# EAGLE design SmartBadge (EAGLE 9.1.3)
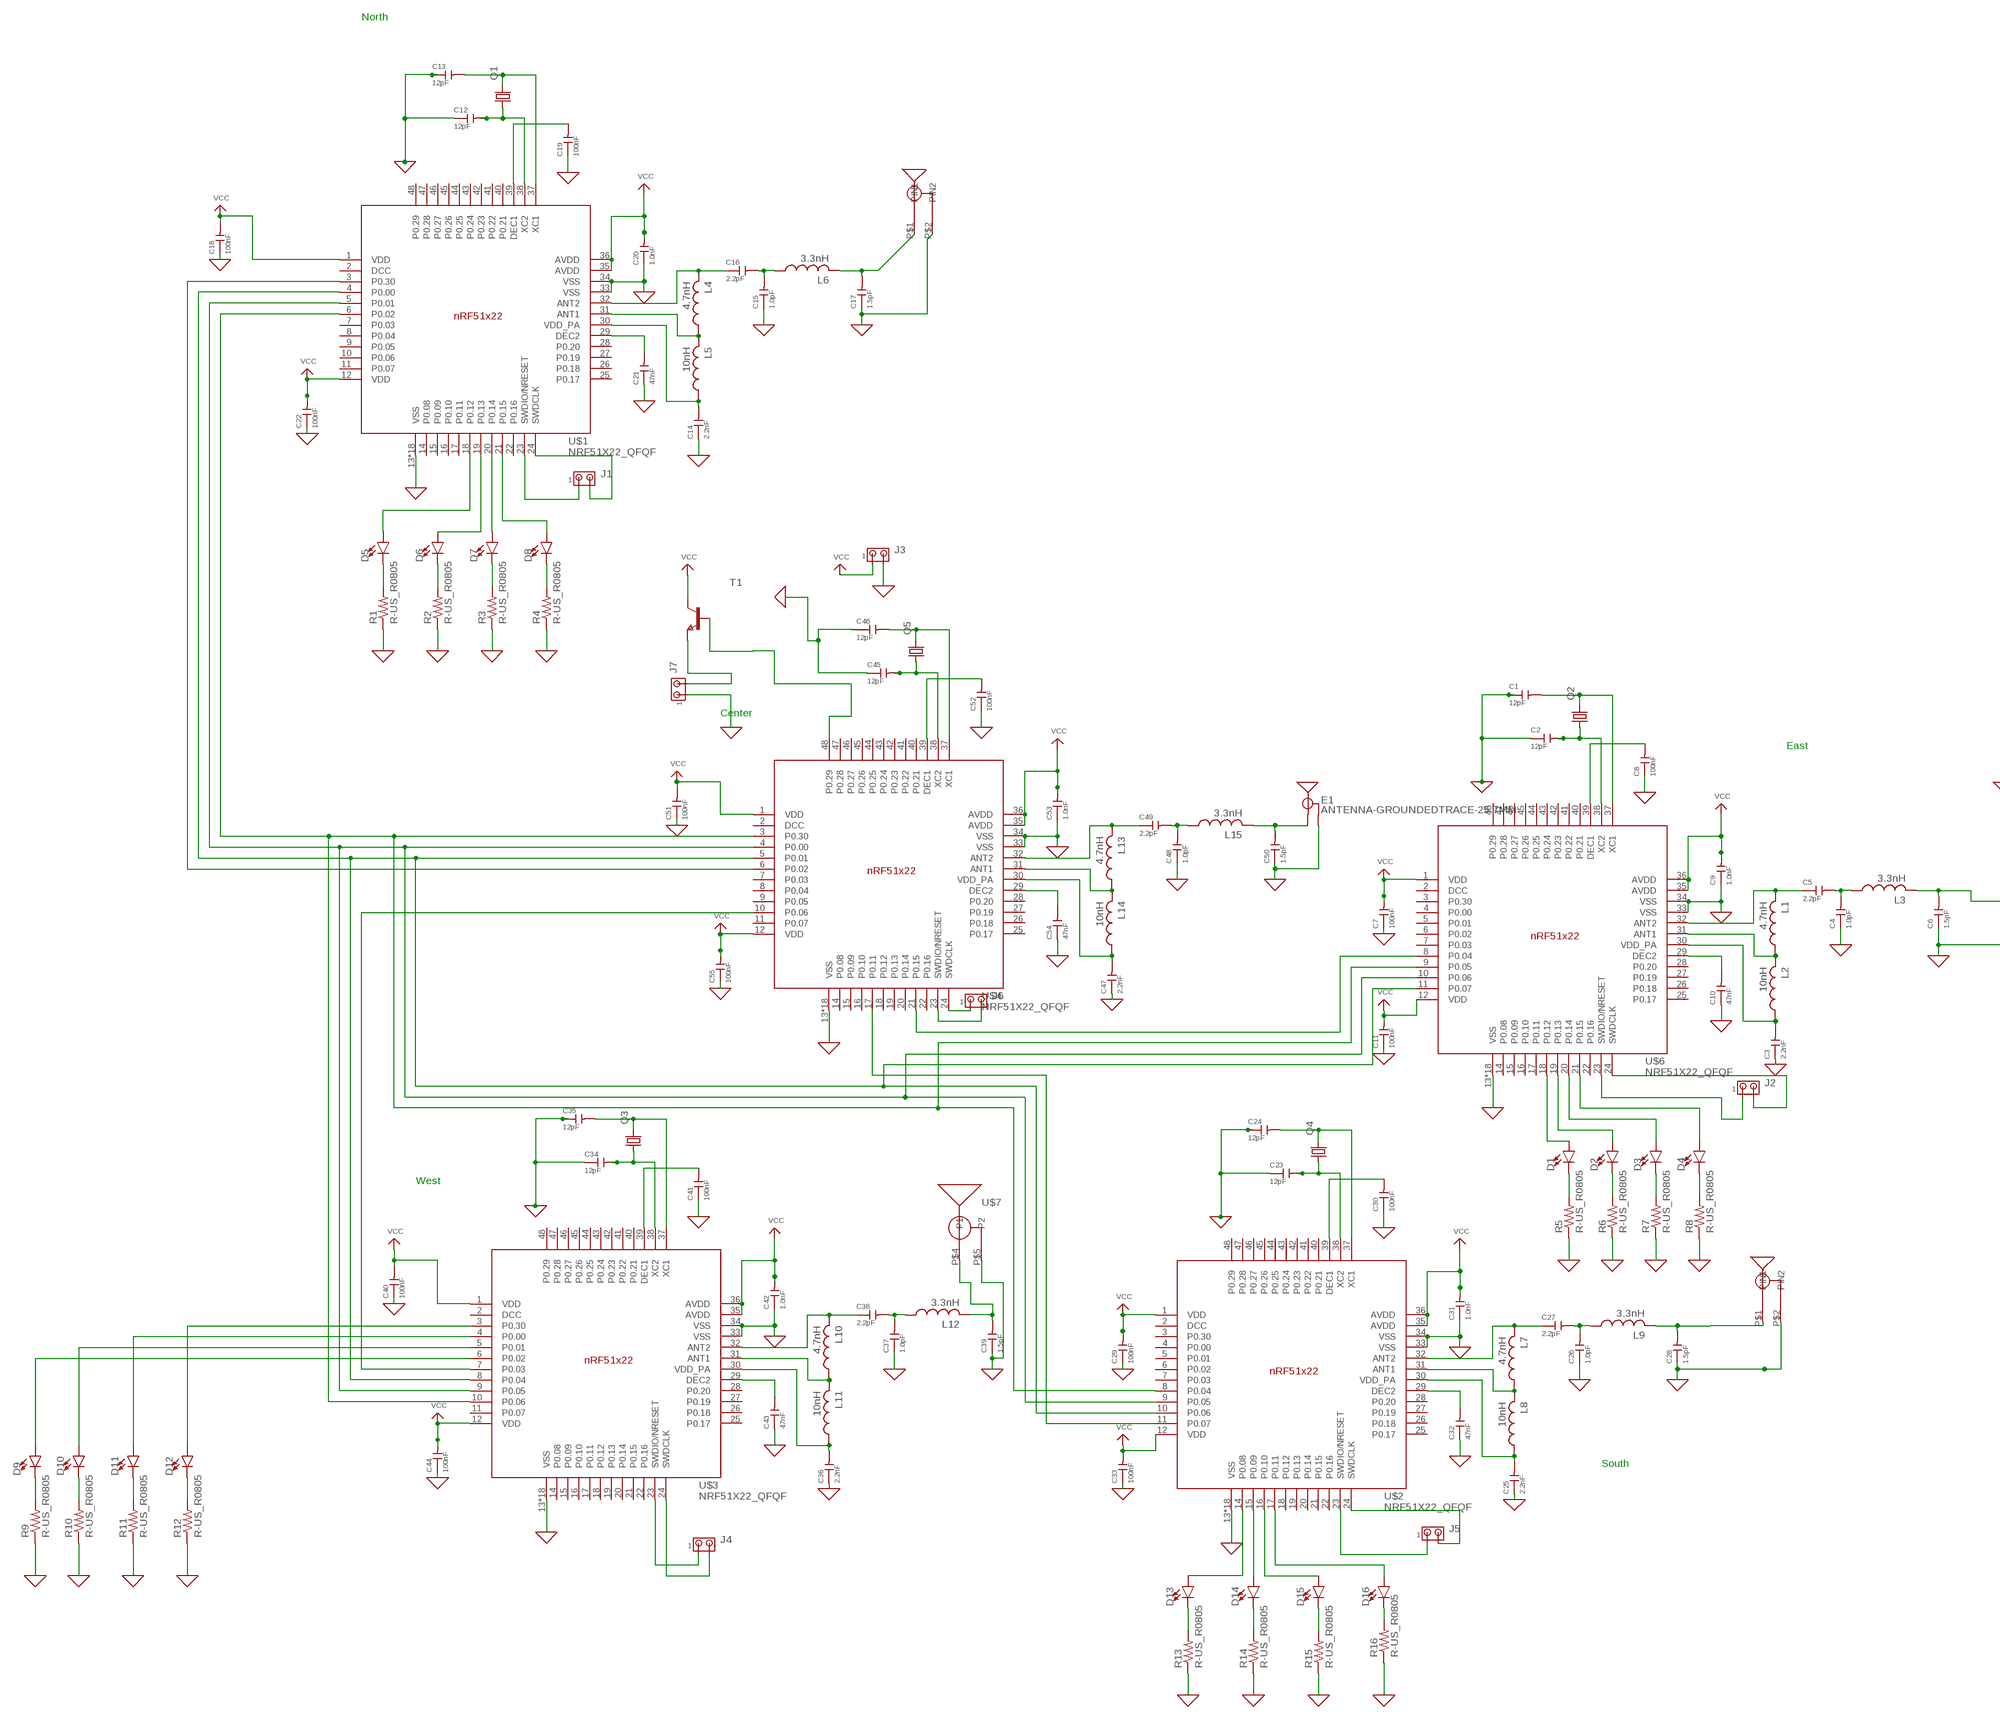
[diagram p0: schematic, sheet 1, part 1 of 2]
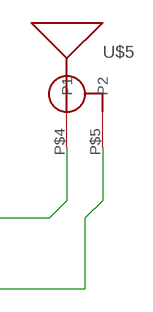
[diagram p1: schematic, sheet 1, part 2 of 2]

## Parts
C1  12pF  CERAMIC-22UF-6.3V-20%-X5R(0805)  [C0805]
C2  12pF  CERAMIC-22UF-6.3V-20%-X5R(0805)  [C0805]
C3  2.2nF  CERAMIC-22UF-6.3V-20%-X5R(0805)  [C0805]
C4  1.0pF  CERAMIC-22UF-6.3V-20%-X5R(0805)  [C0805]
C5  2.2pF  CERAMIC-22UF-6.3V-20%-X5R(0805)  [C0805]
C6  1.5pF  CERAMIC-22UF-6.3V-20%-X5R(0805)  [C0805]
C7  100nF  CERAMIC-22UF-6.3V-20%-X5R(0805)  [C0805]
C8  100nF  CERAMIC-22UF-6.3V-20%-X5R(0805)  [C0805]
C9  1.0nF  CERAMIC-22UF-6.3V-20%-X5R(0805)  [C0805]
C10  47nF  CERAMIC-22UF-6.3V-20%-X5R(0805)  [C0805]
C11  100nF  CERAMIC-22UF-6.3V-20%-X5R(0805)  [C0805]
C12  12pF  CERAMIC-22UF-6.3V-20%-X5R(0805)  [C0805]
C13  12pF  CERAMIC-22UF-6.3V-20%-X5R(0805)  [C0805]
C14  2.2nF  CERAMIC-22UF-6.3V-20%-X5R(0805)  [C0805]
C15  1.0pF  CERAMIC-22UF-6.3V-20%-X5R(0805)  [C0805]
C16  2.2pF  CERAMIC-22UF-6.3V-20%-X5R(0805)  [C0805]
C17  1.5pF  CERAMIC-22UF-6.3V-20%-X5R(0805)  [C0805]
C18  100nF  CERAMIC-22UF-6.3V-20%-X5R(0805)  [C0805]
C19  100nF  CERAMIC-22UF-6.3V-20%-X5R(0805)  [C0805]
C20  1.0nF  CERAMIC-22UF-6.3V-20%-X5R(0805)  [C0805]
C21  47nF  CERAMIC-22UF-6.3V-20%-X5R(0805)  [C0805]
C22  100nF  CERAMIC-22UF-6.3V-20%-X5R(0805)  [C0805]
C23  12pF  CERAMIC-22UF-6.3V-20%-X5R(0805)  [C0805]
C24  12pF  CERAMIC-22UF-6.3V-20%-X5R(0805)  [C0805]
C25  2.2nF  CERAMIC-22UF-6.3V-20%-X5R(0805)  [C0805]
C26  1.0pF  CERAMIC-22UF-6.3V-20%-X5R(0805)  [C0805]
C27  2.2pF  CERAMIC-22UF-6.3V-20%-X5R(0805)  [C0805]
C28  1.5pF  CERAMIC-22UF-6.3V-20%-X5R(0805)  [C0805]
C29  100nF  CERAMIC-22UF-6.3V-20%-X5R(0805)  [C0805]
C30  100nF  CERAMIC-22UF-6.3V-20%-X5R(0805)  [C0805]
C31  1.0nF  CERAMIC-22UF-6.3V-20%-X5R(0805)  [C0805]
C32  47nF  CERAMIC-22UF-6.3V-20%-X5R(0805)  [C0805]
C33  100nF  CERAMIC-22UF-6.3V-20%-X5R(0805)  [C0805]
C34  12pF  CERAMIC-22UF-6.3V-20%-X5R(0805)  [C0805]
C35  12pF  CERAMIC-22UF-6.3V-20%-X5R(0805)  [C0805]
C36  2.2nF  CERAMIC-22UF-6.3V-20%-X5R(0805)  [C0805]
C37  1.0pF  CERAMIC-22UF-6.3V-20%-X5R(0805)  [C0805]
C38  2.2pF  CERAMIC-22UF-6.3V-20%-X5R(0805)  [C0805]
C39  1.5pF  CERAMIC-22UF-6.3V-20%-X5R(0805)  [C0805]
C40  100nF  CERAMIC-22UF-6.3V-20%-X5R(0805)  [C0805]
C41  100nF  CERAMIC-22UF-6.3V-20%-X5R(0805)  [C0805]
C42  1.0nF  CERAMIC-22UF-6.3V-20%-X5R(0805)  [C0805]
C43  47nF  CERAMIC-22UF-6.3V-20%-X5R(0805)  [C0805]
C44  100nF  CERAMIC-22UF-6.3V-20%-X5R(0805)  [C0805]
C45  12pF  CERAMIC-22UF-6.3V-20%-X5R(0805)  [C0805]
C46  12pF  CERAMIC-22UF-6.3V-20%-X5R(0805)  [C0805]
C47  2.2nF  CERAMIC-22UF-6.3V-20%-X5R(0805)  [C0805]
C48  1.0pF  CERAMIC-22UF-6.3V-20%-X5R(0805)  [C0805]
C49  2.2pF  CERAMIC-22UF-6.3V-20%-X5R(0805)  [C0805]
C50  1.5pF  CERAMIC-22UF-6.3V-20%-X5R(0805)  [C0805]
C51  100nF  CERAMIC-22UF-6.3V-20%-X5R(0805)  [C0805]
C52  100nF  CERAMIC-22UF-6.3V-20%-X5R(0805)  [C0805]
C53  1.0nF  CERAMIC-22UF-6.3V-20%-X5R(0805)  [C0805]
C54  47nF  CERAMIC-22UF-6.3V-20%-X5R(0805)  [C0805]
C55  100nF  CERAMIC-22UF-6.3V-20%-X5R(0805)  [C0805]
D1  LED-GREEN0603  [LED-0603]
D2  LED-GREEN0603  [LED-0603]
D3  LED-GREEN0603  [LED-0603]
D4  LED-GREEN0603  [LED-0603]
D5  LED-GREEN0603  [LED-0603]
D6  LED-GREEN0603  [LED-0603]
D7  LED-GREEN0603  [LED-0603]
D8  LED-GREEN0603  [LED-0603]
D9  LED-GREEN0603  [LED-0603]
D10  LED-GREEN0603  [LED-0603]
D11  LED-GREEN0603  [LED-0603]
D12  LED-GREEN0603  [LED-0603]
D13  LED-GREEN0603  [LED-0603]
D14  LED-GREEN0603  [LED-0603]
D15  LED-GREEN0603  [LED-0603]
D16  LED-GREEN0603  [LED-0603]
E1  ANTENNA-GROUNDEDTRACE-25.7MM  [TRACE_ANTENNA_2.4GHZ_25.7MM]
J1  MTA02-100  [10X02MTA]
J2  MTA02-100  [10X02MTA]
J3  MTA02-100  [10X02MTA]
J4  MTA02-100  [10X02MTA]
J5  MTA02-100  [10X02MTA]
J6  MTA02-100  [10X02MTA]
J7  MTA02-100  [10X02MTA]
L1  4.7nH  INDUCTOR_0805_L  [RESC0805_L]
L2  10nH  INDUCTOR_0805_L  [RESC0805_L]
L3  3.3nH  INDUCTOR_0805_L  [RESC0805_L]
L4  4.7nH  INDUCTOR_0805_L  [RESC0805_L]
L5  10nH  INDUCTOR_0805_L  [RESC0805_L]
L6  3.3nH  INDUCTOR_0805_L  [RESC0805_L]
L7  4.7nH  INDUCTOR_0805_L  [RESC0805_L]
L8  10nH  INDUCTOR_0805_L  [RESC0805_L]
L9  3.3nH  INDUCTOR_0805_L  [RESC0805_L]
L10  4.7nH  INDUCTOR_0805_L  [RESC0805_L]
L11  10nH  INDUCTOR_0805_L  [RESC0805_L]
L12  3.3nH  INDUCTOR_0805_L  [RESC0805_L]
L13  4.7nH  INDUCTOR_0805_L  [RESC0805_L]
L14  10nH  INDUCTOR_0805_L  [RESC0805_L]
L15  3.3nH  INDUCTOR_0805_L  [RESC0805_L]
Q1  KX-6  [2.5X2.0_KX-6]
Q2  KX-6  [2.5X2.0_KX-6]
Q3  KX-6  [2.5X2.0_KX-6]
Q4  KX-6  [2.5X2.0_KX-6]
Q5  KX-6  [2.5X2.0_KX-6]
R1  R-US_R0805  [R0805]
R2  R-US_R0805  [R0805]
R3  R-US_R0805  [R0805]
R4  R-US_R0805  [R0805]
R5  R-US_R0805  [R0805]
R6  R-US_R0805  [R0805]
R7  R-US_R0805  [R0805]
R8  R-US_R0805  [R0805]
R9  R-US_R0805  [R0805]
R10  R-US_R0805  [R0805]
R11  R-US_R0805  [R0805]
R12  R-US_R0805  [R0805]
R13  R-US_R0805  [R0805]
R14  R-US_R0805  [R0805]
R15  R-US_R0805  [R0805]
R16  R-US_R0805  [R0805]
T1  NPNSOT323  [SOT323]
U$1  NRF51X22_QFQF  [QFN40P600X600X90-48_N]
U$2  NRF51X22_QFQF  [QFN40P600X600X90-48_N]
U$3  NRF51X22_QFQF  [QFN40P600X600X90-48_N]
U$4  NRF51X22_QFQF  [QFN40P600X600X90-48_N]
U$5  YAGI_UDA  [YAGIUDA]
U$6  NRF51X22_QFQF  [QFN40P600X600X90-48_N]
U$7  YAGI_UDA  [YAGIUDA]
U$8  2.4G_PATCH  [PATCH]
U$9  2.4G_PATCH  [PATCH]

## Nets
0: C1.1 C2.1 C3.1 C4.1 C6.1 C7.1 C8.1 C9.1 C10.1 C11.1 C12.1 C13.1 C14.1 C15.1 C17.1 C18.1 C19.1 C20.1 C21.1 C22.1 C23.1 C24.1 C25.1 C26.1 C28.1 C29.1 C30.1 C31.1 C32.1 C33.1 C34.1 C35.1 C36.1 C37.1 C39.1 C40.1 C41.1 C42.1 C43.1 C44.1 C45.1 C46.1 C47.1 C48.1 C50.1 C51.1 C52.1 C53.1 C54.1 C55.1 E1.GND E1.GND2(GND) J3.2 J7.1 R1.1 R2.1 R3.1 R4.1 R5.1 R6.1 R7.1 R8.1 R9.1 R10.1 R11.1 R12.1 R13.1 R14.1 R15.1 R16.1 U$1.13(VSS) U$1.33(VSS) U$1.34(VSS) U$1.PAD(VSS) U$1.PAD@VIA01(VSS) U$1.PAD@VIA02(VSS) U$1.PAD@VIA03(VSS) U$1.PAD@VIA04(VSS) U$1.PAD@VIA05(VSS) U$1.PAD@VIA06(VSS) U$1.PAD@VIA07(VSS) U$1.PAD@VIA08(VSS) U$1.PAD@VIA09(VSS) U$1.PAD@VIA10(VSS) U$1.PAD@VIA11(VSS) U$1.PAD@VIA12(VSS) U$1.PAD@VIA13(VSS) U$1.PAD@VIA14(VSS) U$1.PAD@VIA15(VSS) U$1.PAD@VIA16(VSS) U$2.13(VSS) U$2.33(VSS) U$2.34(VSS) U$2.PAD(VSS) U$2.PAD@VIA01(VSS) U$2.PAD@VIA02(VSS) U$2.PAD@VIA03(VSS) U$2.PAD@VIA04(VSS) U$2.PAD@VIA05(VSS) U$2.PAD@VIA06(VSS) U$2.PAD@VIA07(VSS) U$2.PAD@VIA08(VSS) U$2.PAD@VIA09(VSS) U$2.PAD@VIA10(VSS) U$2.PAD@VIA11(VSS) U$2.PAD@VIA12(VSS) U$2.PAD@VIA13(VSS) U$2.PAD@VIA14(VSS) U$2.PAD@VIA15(VSS) U$2.PAD@VIA16(VSS) U$3.13(VSS) U$3.33(VSS) U$3.34(VSS) U$3.PAD(VSS) U$3.PAD@VIA01(VSS) U$3.PAD@VIA02(VSS) U$3.PAD@VIA03(VSS) U$3.PAD@VIA04(VSS) U$3.PAD@VIA05(VSS) U$3.PAD@VIA06(VSS) U$3.PAD@VIA07(VSS) U$3.PAD@VIA08(VSS) U$3.PAD@VIA09(VSS) U$3.PAD@VIA10(VSS) U$3.PAD@VIA11(VSS) U$3.PAD@VIA12(VSS) U$3.PAD@VIA13(VSS) U$3.PAD@VIA14(VSS) U$3.PAD@VIA15(VSS) U$3.PAD@VIA16(VSS) U$4.13(VSS) U$4.33(VSS) U$4.34(VSS) U$4.PAD(VSS) U$4.PAD@VIA01(VSS) U$4.PAD@VIA02(VSS) U$4.PAD@VIA03(VSS) U$4.PAD@VIA04(VSS) U$4.PAD@VIA05(VSS) U$4.PAD@VIA06(VSS) U$4.PAD@VIA07(VSS) U$4.PAD@VIA08(VSS) U$4.PAD@VIA09(VSS) U$4.PAD@VIA10(VSS) U$4.PAD@VIA11(VSS) U$4.PAD@VIA12(VSS) U$4.PAD@VIA13(VSS) U$4.PAD@VIA14(VSS) U$4.PAD@VIA15(VSS) U$4.PAD@VIA16(VSS) U$5.P$5(P2) U$6.13(VSS) U$6.33(VSS) U$6.34(VSS) U$6.PAD(VSS) U$6.PAD@VIA01(VSS) U$6.PAD@VIA02(VSS) U$6.PAD@VIA03(VSS) U$6.PAD@VIA04(VSS) U$6.PAD@VIA05(VSS) U$6.PAD@VIA06(VSS) U$6.PAD@VIA07(VSS) U$6.PAD@VIA08(VSS) U$6.PAD@VIA09(VSS) U$6.PAD@VIA10(VSS) U$6.PAD@VIA11(VSS) U$6.PAD@VIA12(VSS) U$6.PAD@VIA13(VSS) U$6.PAD@VIA14(VSS) U$6.PAD@VIA15(VSS) U$6.PAD@VIA16(VSS) U$7.P$5(P2) U$8.P$2(PIN2) U$9.P$2(PIN2) ; supply symbol labelled GND
MISO: U$1.4(P0.00) U$2.10(P0.06) U$3.8(P0.04) U$4.5(P0.01) U$6.11(P0.07)
MOSI: U$1.5(P0.01) U$2.9(P0.05) U$3.9(P0.05) U$4.4(P0.00) U$6.10(P0.06)
N$1: C8.2 U$6.39(DEC1)
N$2: C1.2 Q2.3 U$6.37(XC1)
N$3: C10.2 U$6.29(DEC2)
N$4: C2.2 Q2.1 U$6.38(XC2)
N$5: C5.1 L1.2 U$6.32(ANT2)
N$6: L1.1 L2.2 U$6.31(ANT1)
N$7: C3.2 L2.1 U$6.30(VDD_PA)
N$8: C4.2 C5.2 L3.1
N$9 [tx_line]: C6.2 L3.2 U$5.P$4(P1)
N$10: C13.2 Q1.3 U$1.37(XC1)
N$11: C12.2 Q1.1 U$1.38(XC2)
N$12: C19.2 U$1.39(DEC1)
N$13: C21.2 U$1.29(DEC2)
N$14: C16.1 L4.2 U$1.32(ANT2)
N$15: L4.1 L5.2 U$1.31(ANT1)
N$16: C14.2 L5.1 U$1.30(VDD_PA)
N$17: C15.2 C16.2 L6.1
N$18 [tx_line]: C17.2 L6.2 U$8.P$1(PIN1)
N$19: C24.2 Q4.3 U$2.37(XC1)
N$20: C23.2 Q4.1 U$2.38(XC2)
N$21: C30.2 U$2.39(DEC1)
N$22: C32.2 U$2.29(DEC2)
N$23: C27.1 L7.2 U$2.32(ANT2)
N$24: L7.1 L8.2 U$2.31(ANT1)
N$25: C25.2 L8.1 U$2.30(VDD_PA)
N$26: C26.2 C27.2 L9.1
N$27 [tx_line]: C28.2 L9.2 U$9.P$1(PIN1)
N$28: C35.2 Q3.3 U$3.37(XC1)
N$29: C34.2 Q3.1 U$3.38(XC2)
N$30: C41.2 U$3.39(DEC1)
N$31: C43.2 U$3.29(DEC2)
N$32: C38.1 L10.2 U$3.32(ANT2)
N$33: L10.1 L11.2 U$3.31(ANT1)
N$34: C36.2 L11.1 U$3.30(VDD_PA)
N$35: C37.2 C38.2 L12.1
N$36 [tx_line]: C39.2 L12.2 U$7.P$4(P1)
N$37: C46.2 Q5.3 U$4.37(XC1)
N$38: C45.2 Q5.1 U$4.38(XC2)
N$39: C52.2 U$4.39(DEC1)
N$40: C54.2 U$4.29(DEC2)
N$41: C49.1 L13.2 U$4.32(ANT2)
N$42: L13.1 L14.2 U$4.31(ANT1)
N$43: C47.2 L14.1 U$4.30(VDD_PA)
N$44: C48.2 C49.2 L15.1
N$45 [tx_line]: C50.2 E1.ANT(SIGNAL) L15.2
N$49: U$1.3(P0.30) U$4.6(P0.02)
N$50: J6.2 U$4.23(SWDIO/NRESET)
N$51: T1.2(B) U$4.48(P0.29)
N$52: J7.2 T1.3(E)
N$54: U$3.7(P0.03) U$4.10(P0.06)
N$58: U$2.11(P0.07) U$4.17(P0.11)
N$62: D1.A U$6.18(P0.12)
N$63: D2.A U$6.19(P0.13)
N$64: D3.A U$6.20(P0.14)
N$65: D4.A U$6.21(P0.15)
N$66: D5.A U$1.18(P0.12)
N$67: D6.A U$1.19(P0.13)
N$68: D7.A U$1.20(P0.14)
N$69: D8.A U$1.21(P0.15)
N$70: D12.A U$3.3(P0.30)
N$71: D11.A U$3.4(P0.00)
N$72: D10.A U$3.5(P0.01)
N$73: D9.A U$3.6(P0.02)
N$74: D13.A U$2.14(P0.08)
N$75: D14.A U$2.15(P0.09)
N$76: D15.A U$2.16(P0.10)
N$77: D16.A U$2.17(P0.11)
N$78: D5.C R1.2
N$79: D6.C R2.2
N$80: D7.C R3.2
N$81: D8.C R4.2
N$82: D1.C R5.2
N$83: D2.C R6.2
N$84: D3.C R7.2
N$85: D4.C R8.2
N$86: D13.C R13.2
N$87: D14.C R14.2
N$88: D15.C R15.2
N$89: D16.C R16.2
N$90: D12.C R12.2
N$91: D11.C R11.2
N$92: D10.C R10.2
N$93: D9.C R9.2
N$94: U$4.21(P0.15) U$6.8(P0.04)
N$96: J4.1 U$3.23(SWDIO/NRESET)
N$97: J4.2 U$3.24(SWDCLK)
N$98: J5.1 U$2.23(SWDIO/NRESET)
N$99: J5.2 U$2.24(SWDCLK)
N$102: J2.1 U$6.23(SWDIO/NRESET)
N$103: J2.2 U$6.24(SWDCLK)
N$104: J1.1 U$1.23(SWDIO/NRESET)
N$105: J1.2 U$1.24(SWDCLK)
N$106: J6.1 U$4.24(SWDCLK)
SCK: U$1.6(P0.02) U$2.8(P0.04) U$3.10(P0.06) U$4.3(P0.30) U$6.9(P0.05)
VCC: C7.2 C9.2 C11.2 C18.2 C20.2 C22.2 C29.2 C31.2 C33.2 C40.2 C42.2 C44.2 C51.2 C53.2 C55.2 J3.1 T1.1(C) U$1.1(VDD) U$1.12(VDD) U$1.35(AVDD) U$1.36(AVDD) U$2.1(VDD) U$2.12(VDD) U$2.35(AVDD) U$2.36(AVDD) U$3.1(VDD) U$3.12(VDD) U$3.35(AVDD) U$3.36(AVDD) U$4.1(VDD) U$4.12(VDD) U$4.35(AVDD) U$4.36(AVDD) U$6.1(VDD) U$6.12(VDD) U$6.35(AVDD) U$6.36(AVDD)
Unconnected: U$1.7(P0.03) U$1.8(P0.04) U$1.9(P0.05) U$1.10(P0.06) U$1.11(P0.07) U$1.14(P0.08) U$1.15(P0.09) U$1.16(P0.10) U$1.17(P0.11) U$1.22(P0.16) U$1.25(P0.17) U$1.26(P0.18) U$1.27(P0.19) U$1.28(P0.20) U$1.40(P0.21) U$1.41(P0.22) U$1.42(P0.23) U$1.43(P0.24) U$1.44(P0.25) U$1.45(P0.26) U$1.46(P0.27) U$1.47(P0.28) U$1.48(P0.29) U$2.3(P0.30) U$2.4(P0.00) U$2.5(P0.01) U$2.6(P0.02) U$2.7(P0.03) U$2.18(P0.12) U$2.19(P0.13) U$2.20(P0.14) U$2.21(P0.15) U$2.22(P0.16) U$2.25(P0.17) U$2.26(P0.18) U$2.27(P0.19) U$2.28(P0.20) U$2.40(P0.21) U$2.41(P0.22) U$2.42(P0.23) U$2.43(P0.24) U$2.44(P0.25) U$2.45(P0.26) U$2.46(P0.27) U$2.47(P0.28) U$2.48(P0.29) U$3.11(P0.07) U$3.14(P0.08) U$3.15(P0.09) U$3.16(P0.10) U$3.17(P0.11) U$3.18(P0.12) U$3.19(P0.13) U$3.20(P0.14) U$3.21(P0.15) U$3.22(P0.16) U$3.25(P0.17) U$3.26(P0.18) U$3.27(P0.19) U$3.28(P0.20) U$3.40(P0.21) U$3.41(P0.22) U$3.42(P0.23) U$3.43(P0.24) U$3.44(P0.25) U$3.45(P0.26) U$3.46(P0.27) U$3.47(P0.28) U$3.48(P0.29) U$4.7(P0.03) U$4.8(P0.04) U$4.9(P0.05) U$4.11(P0.07) U$4.14(P0.08) U$4.15(P0.09) U$4.16(P0.10) U$4.18(P0.12) U$4.19(P0.13) U$4.20(P0.14) U$4.22(P0.16) U$4.25(P0.17) U$4.26(P0.18) U$4.27(P0.19) U$4.28(P0.20) U$4.40(P0.21) U$4.41(P0.22) U$4.42(P0.23) U$4.43(P0.24) U$4.44(P0.25) U$4.45(P0.26) U$4.46(P0.27) U$4.47(P0.28) U$6.3(P0.30) U$6.4(P0.00) U$6.5(P0.01) U$6.6(P0.02) U$6.7(P0.03) U$6.14(P0.08) U$6.15(P0.09) U$6.16(P0.10) U$6.17(P0.11) U$6.22(P0.16) U$6.25(P0.17) U$6.26(P0.18) U$6.27(P0.19) U$6.28(P0.20) U$6.40(P0.21) U$6.41(P0.22) U$6.42(P0.23) U$6.43(P0.24) U$6.44(P0.25) U$6.45(P0.26) U$6.46(P0.27) U$6.47(P0.28) U$6.48(P0.29)

## Notes on the sheet
- North
- Center
- East
- West
- South

## Power pins joined to a net without a drawn wire
DCC: U$1.2(DCC) U$2.2(DCC) U$3.2(DCC) U$4.2(DCC) U$6.2(DCC)

## Library data of the parts
C1-C55 = Seeed-Capacitor:CERAMIC-22UF-6.3V-20%-X5R(0805): 302010171; MPN: CC0805MKX5R5BB226; VALUE: 22uf
D1-D16 = SparkFun-LED:LED-GREEN: Green SMD LED Used in manufacturing of various products at SparkFun Packages: 0603 - SMD 0603 package [Product Link] <http://www.futureelectronics.com/en/technologies/semiconductors/optoelectronics/leds/Pages/9894312-LTST-C190GKT.aspx?CrossPart=HSMG-C190&IM=0> LilyPad 1206 - SMD1206 LilyPad package [Product Link] <http://www.futureelectronics.com/en/Technologies/Product.aspx?ProductID=IN150NGHARVATEKCORPORATION2049943&IM=0> 1206 - SMD1206 package [Product Link] <http://www.futureelectronics.com/en/technologies/semiconductors/optoelectronics/leds/Pages/8315665-LTST-C150KGKT.aspx?IM=0> 1206 Bottom Mount -SMD 1206 Bottom Mount [Product Link] <http://www.digikey.com/product-detail/en/lite-on-inc/LTST-C230KGKT/160-1456-1-ND/386854> SparkFun Products: Pro Mini 328 -5V <https://www.sparkfun.com/products/821> RedBoard <https://www.sparkfun.com/products/12757> MP3 Trigger <https://www.sparkfun.com/products/13720> Makey Makey <https://www.sparkfun.com/products/11076>; PROD_ID: DIO-00821; VALUE: GREEN
E1 = SparkFun-RF:ANTENNA-GROUNDED: Antenna w/ Ground Connection 2.4GHz antennae with signal and ground terminals. TRACE_ANTENNA_2.4GHZ_15.2MM - Meander Trace antenna 15.2 x 5.7mm footprint Based on layout from TI app note AN043 <http://www.ti.com/lit/an/swra117d/swra117d.pdf>. TRACE_ANTENNA_2.4GHZ_25.7MM - Inverted F trace antenna 25.7 x 7.5 mm footprint. Based on layout from TI design note DN0007 <http://www.ti.com/lit/an/swru120b/swru120b.pdf>.
J1-J7 = con-amp:MTA02-100: AMP connector
L1-L15 = Nordic_nRF:INDUCTOR: Generic chip inductor
Q1-Q5 = crystal-geyer_V1_0:KX: Quartz Crystals (MHz) SMD: KX - Serie Model Size l/w/h [mm] Frequency Range Frequency Stability Temp. Range [°C] Load Capacitance AECQ 200 availabel Datasheet KX-4 KX-5 KX-6 KX-7 KX-9A KX-9B KX-12A KX-12B KX-13 KX-20 KX-K KX-KS 1.6/1.2/0.3 2.0/1.6/0.45 2.5/2.0/0.55 3.2/2.5/0.8 5.0/3.2/1.0 5.0/3.2/1.1 6.0/3.5/1.1 6.0/3.5/1.0 7.0/5.0 /1.3 11.6/5.5/1.6 12.3/4.5/4.2 12.3/4.5/3.2 24.0 ~ 80.0 MHz 16.0 ~ 80.0 MHz 12.0 ~ 80.0 MHz 8.0 ~ 60.0 MHz 7,68 ~ 300,0 MHz 8,0 ~ 50,0 MHz 8,0 ~ 150,0 MHz 8,0 ~ 50,0 MHz 6,0 ~ 160,0 MHz 3,579 ~ 25,0 MHz 3,579 ~ 70,0 MHz 3,579 ~ 70,0 MHz ±10 … ±50ppm ±10 … ±50ppm ±10 … ±50ppm ±10 … ±50ppm ±10 … ±50ppm ±10 … ±50ppm ±10 … ±50ppm ±10 … ±50ppm ±10 … ±50ppm ±50ppm ±10 … ±50ppm ±10 … ±50ppm (*) -40°C …+85°C (*) -40°C …+125°C (*) -40°C …+125°C (*) -40°C …+125°C (*) -40°C …+105°C (*) -40°C …+105°C (*) -40°C …+125°C (*) -40°C …+105°C (*) -40°C …+105°C (*) -40°C …+105°C (*) -40°C …+85°C (*) -40°C …+85°C 8, 8…16 8, 8…16 10, 8…16 12, 7…20 16, 10…20 16, 10…20 16, 10…20 16, 12…20 16, 12…20 16, 12…20 16, 12…30 16, 12…30 - yes yes yes - - - - - - - - KX-4.pdf <http://www.geyer-electronic.de/uploads/tx_userartikelfrequenz/GEYER-KX-4.pdf> KX-5.pdf <http://www.geyer-electronic.de/uploads/tx_userartikelfrequenz/GEYER-KX-5.pdf> KX-6.pdf <http://www.geyer-electronic.de/uploads/tx_userartikelfrequenz/GEYER-KX-6.pdf> KX-7.pdf <http://www.geyer-electronic.de/uploads/tx_userartikelfrequenz/GEYER-KX-7.pdf> KX-9A.pdf <http://www.geyer-electronic.de/uploads/tx_userartikelfrequenz/GEYER-KX-9A.pdf> KX-9B.pdf <http://www.geyer-electronic.de/uploads/tx_userartikelfrequenz/GEYER-KX-9B.pdf> KX-12A.pdf <http://www.geyer-electronic.de/uploads/tx_userartikelfrequenz/GEYER-KX-12A.pdf> KX-12B.pdf <http://www.geyer-electronic.de/uploads/tx_userartikelfrequenz/GEYER-KX-12B.pdf> KX-13.pdf <http://www.geyer-electronic.de/uploads/tx_userartikelfrequenz/GEYER-KX-13.pdf> KX-20.pdf <http://www.geyer-electronic.de/uploads/tx_userartikelfrequenz/GEYER-KX-20.pdf> KX-K.pdf <http://www.geyer-electronic.de/uploads/tx_userartikelfrequenz/GEYER-KX-K.pdf> KX-KS.pdf <http://www.geyer-electronic.de/uploads/tx_userartikelfrequenz/GEYER-KX-KS.pdf> <http://www.geyer-electronic.de/fileadmin/template/img/logo-geyer-electronic.png> Details see: http://www.geyer-electronic.de/Frequenz-Produkte.9.0.html Created 2016-06-07, Hans Locher 2016 (C) Geyer Quartz Technology KX4,KX5,KX6,KX7,KX9A,KX9B,KX12A,KX12B,KX13,KX20,KXK,KXKS;1612;2016;2520;3225;5032;6035;7050;11655;12345;1,6x1,2;2,0x1,6;2,5x2,0;3,2x2,5;5,0x3,2;6,0x3,5;7,0x5,0;11,6x5,5;12,3x4,5;12,3x4,5;1.6x1.2;2.0x1.6;2.5x2.0;3.2x2.5;5.0x3.2;6.0x3.5;7.0x5.0;11.6x5.5;12.3x4.5;12.3x4.5;
R1-R16 = audio amplifier example:R-US_: RESISTOR, American symbol
T1 = zetex:NPNSOT323: NPN TRANSISTOR; MPN: DSS4160U-7; OC_FARNELL: 1710696; OC_NEWARK: 25R4558
U$1-U$4 U$6 = Nordic_nRF:NRF51X22_QF: nRF51x22 For devices: nRF51422 nRF51822 Features Single chip, highly flexible, 2.4 GHz multi-protocol device 32-bit ARM Cortex M0 CPU core 256kB/128kB flash + 32kB/16kB RAM Supports Bluetooth low energy protocol stacks Thread safe and run-time protected Event driven API On air compatible with nRF24L series 3 data rates (2Mbps/1Mbps/250kbps) +4dBm output power -93dBm sensitivity, Bluetooth low energy PPI system for maximum power-efficient applications and code simplification Flexible power management system with automatic power management of each peripheral Configurable I/O mapping for analog and digital I/O Applications Mobile phone accessories Wearables Beacons Rezence wireless charging monitoring PC peripherals Consumer Electronics (CE) remote controls Proximity/Alert sensors Smart Home Sports, fitness and healthcare sensors Smart RF tags Toys and electronic games Intelligent domestic appliances Industrial and commercial sensors Lighting
U$5 U$7 = Myown:YAGI_UDA
U$8 U$9 = Patch:2.4G_PATCH

## Net classes
1 tx_line: width 2.8 mm, clearance 1.5 mm

## Board
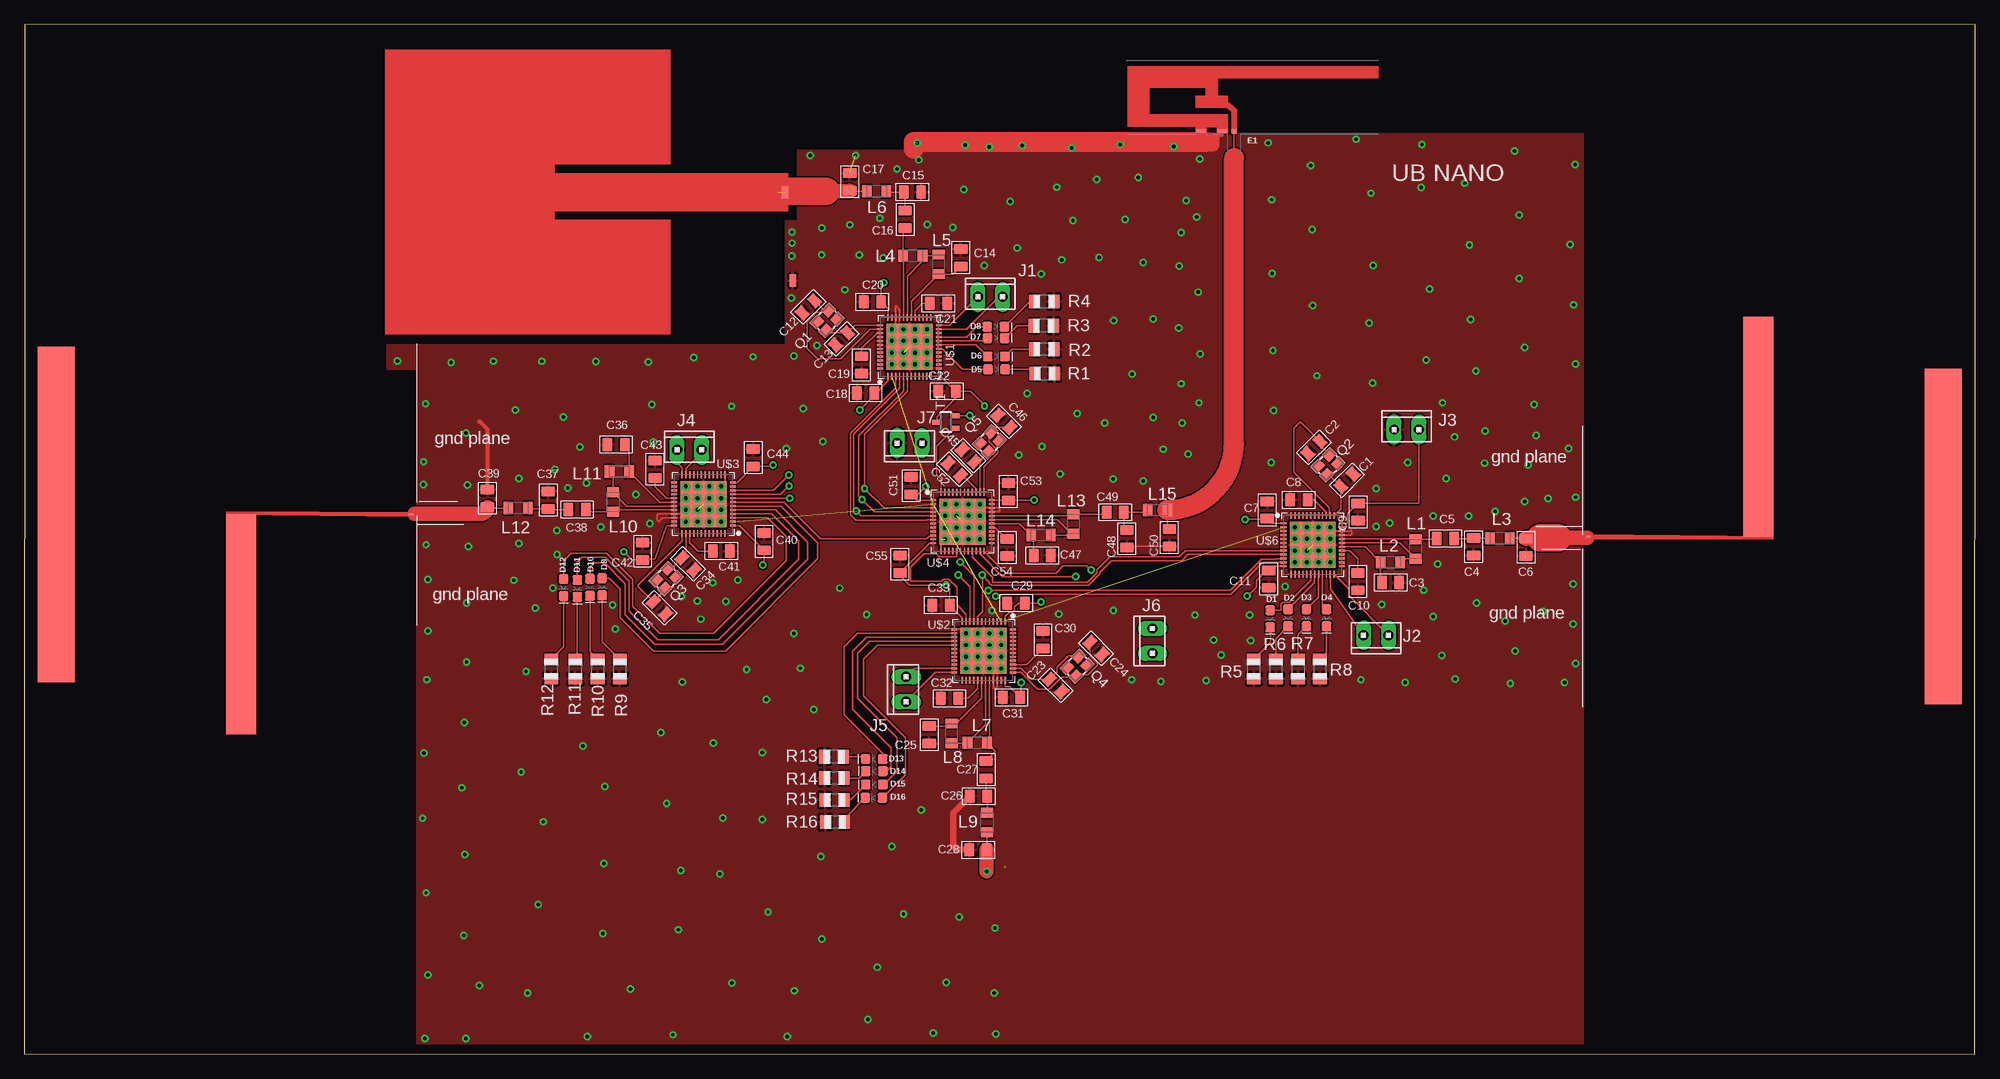
[diagram p2: board, top side]
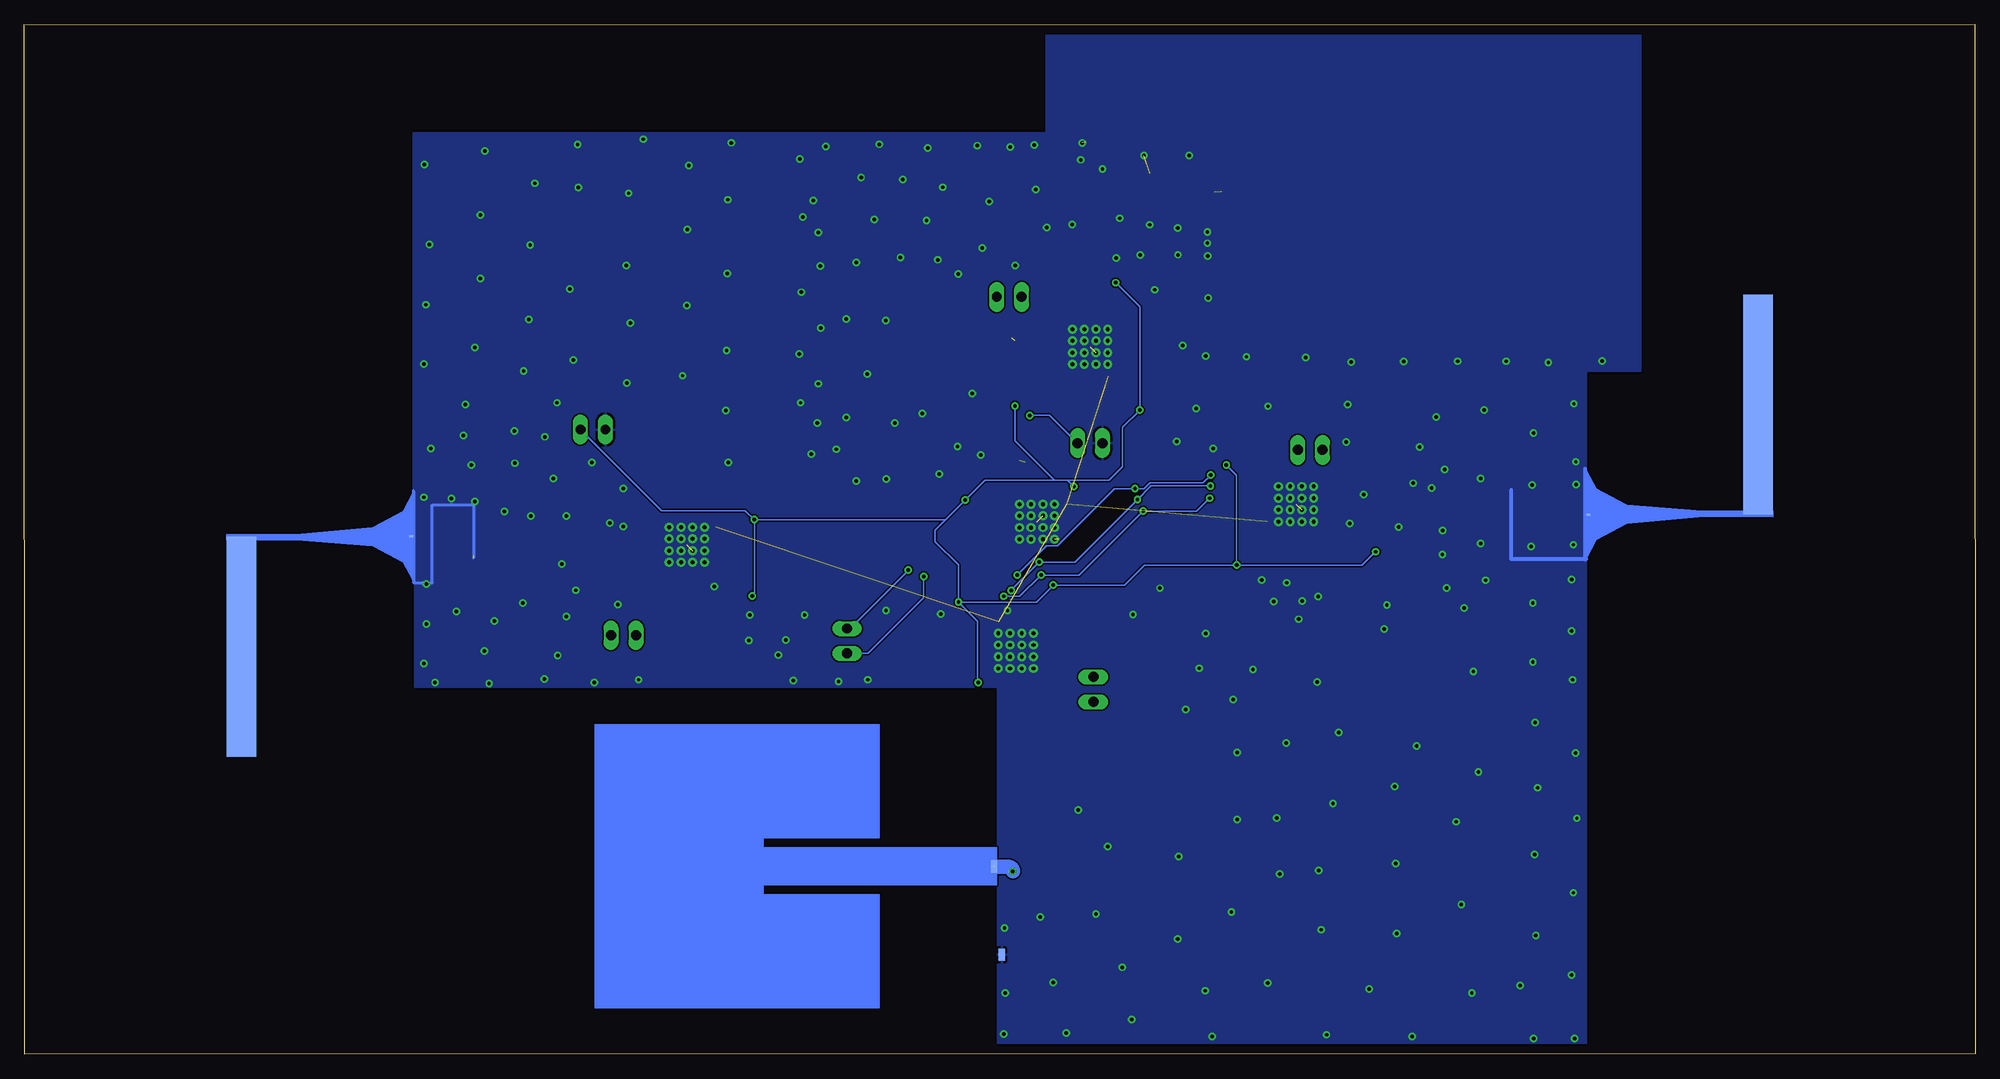
[diagram p3: board, bottom side, seen from below]

Size 199.49 x 105.27 mm. Coordinates in mm from the lower left corner, seen from the top.
Outline: 0,0.05 199.47,0 199.49,105.22 0.03,105.27 0,0.05
Copper layers (1*16): Top 0.035mm / dielectric 1.5mm / Bottom 0.035mm
Design rules "default": minimum track width 6mil, minimum drill 0.35mm, track to track 6mil, track to pad 6mil, pad to pad 6mil, via to via 6mil, smd to smd 6mil, copper to edge 40mil, drill to drill 6mil, minimum pad ring 10mil, minimum via ring 8mil, stop-mask expansion 4mil, vias tented up to drill 0mil, thermal gap 10mil

### Footprints (pad centres in the part's own frame; a part is rotated, then mirrored left to right if it is on the bottom)
C0805 = smd 1.397 x 1.016: 1 0,0.889; 2 0,-0.889
LED-0603 = smd 1 x 1: A -0.877,0; C 0.877,0
TRACE_ANTENNA_2.4GHZ_25.7MM = smd 0.46 x 0.46: ANT 0,0.23 | smd 1 x 0.46: GND -1.18,0.23; GND2 -3.38,0.23
10X02MTA = drill 1.016 long: 1 1.27,0; 2 -1.27,0
RESC0805_L = smd 1 x 1.25: 1 -1,0; 2 1,0
2.5X2.0_KX-6 = smd 1.2 x 1: 1 -0.85,-0.65; 2 0.85,-0.65; 3 0.85,0.65; 4 -0.85,0.65
R0805 = smd 1.1 x 1.4: 1 -1,0; 2 1,0
SOT323 = smd 0.5 x 1: 1 0,0.9; 2 -0.65,-0.9; 3 0.65,-0.9
QFN40P600X600X90-48_N = smd 0.65 x 0.2: 1 -3,2.2; 2 -3,1.8; 3 -3,1.4; 4 -3,1; 5 -3,0.6; 6 -3,0.2; 7 -3,-0.2; 8 -3,-0.6; 9 -3,-1; 10 -3,-1.4; 11 -3,-1.8; 12 -3,-2.2; 25 3,-2.2; 26 3,-1.8; 27 3,-1.4; 28 3,-1; 29 3,-0.6; 30 3,-0.2; 31 3,0.2; 32 3,0.6; 33 3,1; 34 3,1.4; 35 3,1.8; 36 3,2.2 | smd 0.2 x 0.65: 13 -2.2,-3; 14 -1.8,-3; 15 -1.4,-3; 16 -1,-3; 17 -0.6,-3; 18 -0.2,-3; 19 0.2,-3; 20 0.6,-3; 21 1,-3; 22 1.4,-3; 23 1.8,-3; 24 2.2,-3; 37 2.2,3; 38 1.8,3; 39 1.4,3; 40 1,3; 41 0.6,3; 42 0.2,3; 43 -0.2,3; 44 -0.6,3; 45 -1,3; 46 -1.4,3; 47 -1.8,3; 48 -2.2,3 | smd 4.7 x 4.7: PAD 0,0 | drill 0.4: PAD@VIA01 -1.8,1.8; PAD@VIA02 -1.8,0.6; PAD@VIA03 -1.8,-0.6; PAD@VIA04 -1.8,-1.8; PAD@VIA05 -0.6,1.8; PAD@VIA06 -0.6,0.6; PAD@VIA07 -0.6,-0.6; PAD@VIA08 -0.6,-1.8; PAD@VIA09 0.6,1.8; PAD@VIA10 0.6,0.6; PAD@VIA11 0.6,-0.6; PAD@VIA12 0.6,-1.8; PAD@VIA13 1.8,1.8; PAD@VIA14 1.8,0.6; PAD@VIA15 1.8,-0.6; PAD@VIA16 1.8,-1.8
YAGIUDA = smd 3.81 x 34.29: P$1 0,0 | smd 3.05 x 22.48: P$4 -18.92,11.24 | smd 3.05 x 22.48 bottom: P$5 -18.94,-11.25 | smd 0.406 x 0.203: P$6 -36.299,0 | smd 0.406 x 0.203 bottom: P$7 -36.311,0.012
PATCH = smd 1.27 x 0.635: P$1 -0.018,-11.677; P$2 -9.047,-12.48

### Placement (x,y rotation side)
C1  135.25,58.67 315 top
C2  131.88,62.03 135 top
C3  139.73,48.21 270 top
C4  148.21,51.87 180 top
C5  145.31,52.71 90 top
C6  153.57,51.82 180 top
C7  127.1,55.63 0 top
C8  130.33,56.67 90 top
C9  136.4,55.42 180 top
C10  136.37,48.31 180 top
C11  127.25,48.56 180 top
C12  80.16,76.4 135 top
C13  83.57,73.13 135 top
C14  95.76,81.43 0 top
C15  90.81,88.14 270 top
C16  90.07,85.34 180 top
C17  84.4,89.18 0 top
C18  86.03,67.59 90 top
C19  85.6,70.46 180 top
C20  86.72,76.91 90 top
C21  93.47,76.76 270 top
C22  94.34,67.77 90 top
C23  105.46,37.69 225 top
C24  109.6,41.48 225 top
C25  92.53,32.64 180 top
C26  97.59,26.37 90 top
C27  98.35,29.08 0 top
C28  97.54,20.88 90 top
C29  101.42,46.1 90 top
C30  104.17,42.37 0 top
C31  100.94,36.47 90 top
C32  94.61,36.37 90 top
C33  93.73,45.9 90 top
C34  67.87,50.11 225 top
C35  64.95,45.62 225 top
C36  60.5,62.31 90 top
C37  53.57,56.64 0 top
C38  56.52,55.68 270 top
C39  47.35,56.82 0 top
C40  75.64,52.4 0 top
C41  71.27,51.44 270 top
C42  63.22,51.41 0 top
C43  64.49,59.79 0 top
C44  74.52,60.99 0 top
C45  96.55,61.19 45 top
C46  100.18,64.69 45 top
C47  104.09,50.98 270 top
C48  112.75,52.68 180 top
C49  111.56,55.4 90 top
C50  117.09,52.81 180 top
C51  90.68,58.12 0 top
C52  95.1,59.79 45 top
C53  100.63,57.51 0 top
C54  100.51,51.79 180 top
C55  89.53,50.09 0 top
D1  127.41,44.5 270 top
D2  129.24,44.6 270 top
D3  131.11,44.6 270 top
D4  133.17,44.6 270 top
D5  99.42,70 0 top
D6  99.39,71.32 0 top
D7  99.36,73.2 0 top
D8  99.34,74.37 0 top
D9  59.08,47.78 270 top
D10  57.84,47.73 270 top
D11  56.54,47.6 270 top
D12  55.14,47.7 270 top
D13  86.89,30.18 180 top
D14  86.92,28.93 180 top
D15  86.92,27.56 180 top
D16  86.87,26.21 180 top
E1  123.7,94.08 0 top
J1  98.78,77.42 0 top
J2  138.23,42.82 180 top
J3  141.35,63.86 0 top
J4  68,61.77 0 top
J5  90.17,37.29 90 top
J6  115.37,42.24 90 top
J7  90.53,62.46 180 top
L1  142.29,51.64 90 top
L2  139.7,50.29 0 top
L3  150.9,52.73 0 top
L4  90.86,81.64 180 top
L5  93.5,80.75 90 top
L6  87.15,88.21 180 top
L7  97.43,31.83 0 top
L8  94.84,32.79 270 top
L9  98.45,23.67 270 top
L10  60.2,56.44 270 top
L11  60.83,59.56 180 top
L12  50.5,55.83 180 top
L13  107.26,54.2 90 top
L14  103.96,53.06 0 top
L15  115.87,55.63 0 top
Q1  82.09,75.01 225 top
Q2  133.32,60.25 225 top
Q3  65.63,48.62 225 top
Q4  107.67,39.65 225 top
Q5  98.7,62.59 45 top
R1  104.34,69.57 180 top
R2  104.29,72.06 180 top
R3  104.24,74.47 180 top
R4  104.29,76.94 180 top
R5  125.73,39.37 90 top
R6  127.99,39.37 90 top
R7  130.25,39.37 90 top
R8  132.49,39.37 90 top
R9  60.88,39.37 90 top
R10  58.62,39.37 90 top
R11  56.34,39.37 90 top
R12  53.87,39.37 90 top
R13  82.8,30.4 0 top
R14  82.83,28.22 0 top
R15  82.85,25.98 0 top
R16  82.91,23.72 0 top
T1  94.23,64.62 90 top
U$1  90.5,72.31 90 top
U$2  98.09,41.22 270 top
U$3  69.44,56.24 180 top
U$4  95.94,54.43 0 top
U$5  196.24,52.91 0 top
U$6  131.75,52.07 0 top
U$7  3.25,55.17 180 top
U$8  66.09,88.14 90 top
U$9  112.01,19.2 90 bottom

### Tracks (layer width: path | path; a pad name or v marks a point on that pad's centre or on a via)
0  (via drill 0.35)  (8 unrouted)
  Top 0.152: U$1.33 89.5,76.12 89.13,76.49 89.1,76.45 U$1.34 89.1,74.51 U$1.PAD@VIA13 | U$4.33 98.97,55.46 99.7,55.46 99.7,55.79 99.65,55.83 U$4.34 98.14,55.83 U$4.PAD@VIA13 | U$2.34 99.5,37.53 99.51,37.51 99.43,37.51 99.24,37.32 99.09,37.47 U$2.33 99.09,39.02 U$2.PAD@VIA14 | U$6.33 135.6,53.07 135.75,53.22 135.75,53.58 135.65,53.47 U$6.34 133.95,53.47 U$6.PAD@VIA13 | U$3.PAD@VIA14 67.24,55.24 U$3.33 64.86,55.24 64.7,55.08 64.7,54.59 64.86,54.43 65.27,54.84 U$3.34 | C50.1 112.88,51.92 C48.1 | U$2.PAD 95.89,43.42 U$2.13 | U$3.PAD@VIA10 71.64,58.44 U$3.13 | U$4.13 93.74,52.64 94.31,53.21
  Top 0.254: 120.8,93.61 120.8,93.93 | 121.08,93.24 120.8,93.24
  Top 0.305: E1.GND2 120.32,93.93 120.8,93.93 121.79,93.93 122.52,93.93 E1.GND
  Top 0.406: C39.1 47.35,63.89 46.55,64.69
  Top 0.61: C28.1 95.37,20.88 95,21.26 95,24.66 C26.1
  Top 1.27: 120.8,93.24 120.8,92.94 121.56,92.94 121.56,93.61 120.8,93.61
  Top 2.032: 120.8,93.24 90.94,93.24 90.94,92.6
  Bottom 0.152: U$5.P$5 177.3,52.86 160.5,52.86
  Bottom 0.305: 160.5,52.86 159.69,52.86 159.69,57.61 159.69,48.21 157.78,48.21 157.78,56.16 153.57,56.16 153.57,50.72 153.59,50.72
  Bottom 0.406: U$7.P$5 22.19,55.28 39.87,55.28 39.87,59.81 39.89,59.81 39.89,50.61 39.78,50.61 47.43,50.61 47.43,57.66
  other vias: 89.24,90.5 91.47,91.43 91.33,93.16 85,91.87 80.39,91.87 68.44,71.21 58.44,70.8 59.17,12.31 109.68,89.42 113.93,89.63 118.32,84.02 111.41,75.02 113.28,69.54 115.44,65.08 102.56,67.53 111.34,58.81 105.94,59.32 105.58,88.63 100.83,87.19 96.08,88.41 98.17,80.63 94.93,84.52 92.34,84.81 104,79.77 52.92,70.83 101.69,61.26 98.67,92.73 102.05,92.88 107.09,92.66 112.06,93.02 117.53,92.8 118.82,87.26 118.1,80.56 118.03,74.22 118.32,68.53 67.14,18.77 112.56,85.31 107.23,85.24 109.9,81.43 114.43,80.92 115.44,75.16 107.67,65.51 110.47,64.5 104.07,62.13 106.08,81.21 101.55,82.43 96.22,92.95 118.39,64.5 116.45,61.84 114.43,58.6 119.04,61.33 120.12,66.59 120.26,71.56 120.05,77.9 119.9,85.6 120.19,91.51 141.22,38 151.97,37.9 143.1,47.42 138.8,45.96 141.48,60.47 138.24,57.83 145.02,66.59 137.88,68.63 143.34,70.97 137.52,74.75 143.7,78.23 137.94,80.63 142.86,88.61 137.7,88.01 136.2,93.53 131.53,90.83 131.71,84.29 131.76,76.55 132.19,69.35 63.82,70.78 43.63,70.72 38.14,70.86 41.03,66.49 40.83,60.56 40.8,58.25 45.28,58.16 50.57,58.86 45.17,63.51 50.23,65.86 57.46,58.37 62.55,57.21 56.82,62.07 55.58,57.87 64.31,62.56 54.25,59.75 55.11,65.13 64.17,66.41 72.32,66.23 77.9,61.9 79.64,66 81.66,62.62 83.36,47.63 86.12,44.93 78.69,43.01 80.73,35.21 67.29,38.03 75.87,36.23 65.07,32.87 75.45,30.83 70.47,31.79 75.45,23.99 81.45,20.21 91.7,24.95 88.7,21.23 95.6,14.03 89.9,14.33 99.26,12.89 99.2,6.23 99.32,2.03 92.96,2.15 94.28,7.31 87.2,8.87 86.24,3.53 81.57,11.75 78.75,6.47 76.05,14.51 72.33,7.25 78.03,1.79 66.33,1.97 57.58,1.79 45.16,1.61 40.96,1.61 41.26,8.09 41.08,16.49 40.72,24.11 40.84,30.77 41.14,38.27 41.26,43.25 41.26,48.53 41.08,52.07 45.4,51.89 50.56,52.19 45.22,46.13 45.22,40.07 44.98,33.89 44.74,27.23 45.04,20.39 44.92,12.11 51.46,6.23 46.54,7.01 52.54,15.29 61.95,6.65 66.87,12.71 71.13,18.41 65.67,25.61 59.26,19.49 53.08,23.75 59.38,27.35 50.8,28.85 57.1,31.49 52.24,45.59 105.8,44.99 111.37,45.35 113.23,38.27 120.85,38.21 116.23,38.09 122.41,40.79 125.29,44.87 128.95,47.81 125.41,42.29 121.63,42.35 119.71,44.87 136.68,38.27 146.34,38.33 157.49,37.97 152.46,41.21 158.39,48.05 158.63,39.95 158.39,43.97 155.34,45.23 148.5,46.13 144.06,44.75 144.96,40.73 151.44,44.27 158.63,56.93 155.81,56.81 153.42,56.51 150.42,55.49 147.72,55.01 144.06,55.01 139.62,54.29 138.24,53.93 144.54,50.09 145.38,58.85 149.34,60.41 153.78,60.23 157.91,61.91 154.38,66.41 149.4,63.71 146.28,63.11 154.62,63.23 158.63,70.55 158.45,76.61 158.09,82.79 158.57,90.95 152.4,92.33 152.88,85.79 152.88,79.31 153.42,72.23 147.9,75.11 148.44,69.83 147.78,82.73 147.3,89.03 142.92,92.99 127.21,93.17 127.57,87.35 127.63,79.79 127.69,71.93 127.75,65.81 127.51,60.47 74.52,71.3 78.7,71.38 87.84,81.38 85.37,81.7 71.44,24.15 47.97,70.83 83.91,78.15 81.52,81.72 78.47,81.6 78.51,82.91 78.51,84.05 81.54,84.45 84.41,84.79 87.46,85.46 78.43,77.32 72.94,48.45 71.74,46.29 68.81,46.32 69.16,44.46 70.41,48.19 79.36,39.45 73.85,39.33 54.46,53.53 58.96,53.88 63.95,54.25 54.48,51.09 50.05,48.44 51.31,39.12 60.42,43.46 60.15,45.92 54.03,47.67 67.19,46.78 98.95,45.36 81.03,72.46
  pour Top: 37.11,72.52 77.83,72.52 77.83,72.59 77.83,85.19 79.04,85.19 79.07,92.41 112.7,92.41 112.7,94.11 159.44,94.11 159.44,81.64 159.44,62.87 159.44,0.1 158.45,0.1 40.13,0.1 40.13,70.03 37.11,70.03
  pour Bottom: 159.74,57.35 159.74,94.21 158.14,94.21 95,94.21 95,105.13 34.16,105.13 34.16,69.8 39.75,69.8 39.75,57.76 39.75,-0.03 54,-0.03 100,-0.03 100,37.52 159.56,37.52 159.56,57.18
DCC  (4 unrouted)
MISO  (via drill 0.35)
  Top 0.152: U$1.4 89.5,68.11 89.52,68.09 89.41,67.98 89.41,67.96 84.81,63.37 84.81,55.78 v85.08,55.51 85.54,55.05 92.92,55.05 U$4.5 | v78.29,56.83 U$3.8 | v95.52,48.97 96.69,47.79 U$2.10 | v99.33,46.81 99.79,46.81 100,47.03 123.37,47.03 126.53,50.19 126.64,50.19 126.76,50.31 128.71,50.31 U$6.11
  Bottom 0.152: v78.29,56.83 79.61,55.51 v85.08,55.51 91.62,48.97 v95.52,48.97 97.7,46.78 98.82,46.78 98.84,46.81 v99.33,46.81
MOSI  (via drill 0.35)
  Top 0.152: U$1.5 89.9,68.08 89.89,68.07 89.89,67.79 85.31,63.21 85.31,57.05 v85.66,56.7 86.93,55.43 U$4.4 | v78.2,58.09 77.35,57.24 U$3.9 | v95.72,50.3 97.09,48.92 U$2.9 | v98.56,47.39 99.05,47.39 99.08,47.42 123.33,47.42 126.52,50.61 128,50.61 128.06,50.66 128.64,50.66 128.69,50.61 U$6.10
  Bottom 0.152: v78.2,58.09 84.27,58.09 v85.66,56.7 92.06,50.3 v95.72,50.3 98.56,47.45 v98.56,47.39
N$1
  Top 0.152: U$6.39 133.08,55.14 133.08,55.47 131.88,56.67 C8.2
N$2
  Top 0.152: U$6.37 134.63,55.75 C1.2 133.48,59.19 Q2.3
N$3
  Top 0.152: U$6.29 135.55,51.47 136.37,50.65 C10.2
N$4
  Top 0.152: U$6.38 133.48,55.14 133.48,55.86 129.84,59.5 129.84,63.97 130.52,64.64 C2.2 132.5,62.27 Q2.1
N$5
  Top 0.152: U$6.32 142.26,52.67 L1.2 144.36,52.64 C5.1
N$6
  Top 0.152: L2.2 141.05,50.64 L1.1 140.66,52.27 U$6.31
N$7
  Top 0.152: U$6.30 137.12,51.87 L2.1 138.7,48.35 C3.2
N$8
  Top 0.152: C5.2 148.16,52.7 C4.2 149.88,52.76 L3.1
N$9
  Top 0.152: L3.2 153.54,52.73 C6.2 | 159.82,52.78 177.32,52.78 U$5.P$4
  Top 1.499: C6.2 arc-90 153.65,52.78 155.02,52.78 | 156.82,52.78 159.82,52.78
  Top 2.8: 155.02,52.78 156.82,52.78
N$10
  Top 0.152: U$1.37 84.95,74.51 C13.2 82.14,73.75 Q1.3
N$11
  Top 0.152: U$1.38 86.5,74.11 83.48,71.09 81.11,71.09 80.03,72.18 80.03,74.89 81.01,75.87 82.04,75.87 Q1.1 81.76,76.07 C12.2
N$12
  Top 0.152: C19.2 85.6,72.14 87.17,73.72 U$1.39
N$13
  Top 0.152: U$1.29 91.1,76.01 91.85,76.76 C21.2
N$14
  Top 0.152: U$1.32 89.9,81.59 L4.2 89.86,84.24 C16.1
N$15
  Top 0.152: U$1.31 90.3,79.55 91.86,81.1 L4.1 93.39,81.64 L5.2
N$16
  Top 0.152: U$1.30 90.7,76.95 L5.1 94.96,79.75 C14.2
N$17
  Top 0.152: C16.2 90.07,87.99 C15.2 88.22,88.14 L6.1
N$18  (1 unrouted)
  Top 0.152: L6.2 84.48,88.21 C17.2 arc-90 84.28,88.16 77.06,88.16
  Top 1.499: C17.2 arc-90 84.35,88.24 82.83,88.24 81.99,88.24 | 75.69,88.24 76.73,88.24
  Top 2.8: 76.73,88.24 81.99,88.24
N$19
  Top 0.152: U$2.37 101.9,39.02 103.63,37.29 104.84,37.29 106.05,38.5 106.63,38.5 106.72,38.59 Q4.3 107.72,38.78 108.75,38.78 109.74,39.77 109.74,39.96 108.97,40.72 C24.2
N$20
  Top 0.152: U$2.38 101.93,39.42 103.03,38.32 C23.2 105.6,39.09 105.6,39.53 106.78,40.71 Q4.1
N$21
  Top 0.152: U$2.39 101.88,39.82 101.91,39.8 102.49,39.8 C30.2
N$22
  Top 0.152: U$2.29 97.5,37.4 97.51,37.39 96.5,36.37 C32.2
N$23
  Top 0.152: U$2.32 98.69,32.09 L7.2 99.32,30.94 C27.1
N$24
  Top 0.152: U$2.31 98.3,33.69 L7.1 96.4,31.79 L8.2
N$25
  Top 0.152: U$2.30 97.89,36.4 95.28,33.79 L8.1 94.58,33.53 C25.2
N$26
  Top 0.152: C27.2 98.35,26.49 C26.2 98.48,24.7 L9.1
N$27  (via drill 0.35)  (1 unrouted)
  Top 0.152: L9.2 98.45,20.9 C28.2
  Top 1.499: C28.2 arc90 98.4,20.85 v98.4,18.67
  Bottom 1.499: v98.4,18.67 arc-90 98.86,19.13 100.31,19.13 104.27,19.13
N$28
  Top 0.152: U$3.37 67.24,52.46 62.76,47.98 62.76,47.8 C35.2 65.49,47.42 Q3.3
N$29
  Top 0.152: U$3.38 67.64,51.15 C34.2 66.17,49.68 Q3.1
N$30
  Top 0.152: U$3.39 68.04,52.28 68.89,51.43 C41.2
N$31
  Top 0.152: U$3.29 65.67,56.84 65.66,56.82 64.49,57.99 C43.2
N$32
  Top 0.152: U$3.32 60.4,55.64 L10.2 57.64,55.44 C38.1
N$33
  Top 0.152: U$3.31 61.6,56.04 L10.1 60.2,59.2 L11.2
N$34
  Top 0.152: U$3.30 64.96,56.44 L11.1 61.83,61.86 C36.2
N$35
  Top 0.152: C38.2 53.65,55.68 C37.2 51.57,55.75 L12.1
N$36
  Top 0.152: L12.2 47.45,55.83 C39.2 | 39.9,55.24 22.17,55.24 U$7.P$4
  Top 1.499: C39.2 arc-90 46.66,55.24 39.9,55.24
N$37
  Top 0.152: U$4.37 98.14,60.07 99.57,61.5 99.57,61.69 98.65,62.61 98.65,63.45 Q5.3 99.27,64.06 C46.2
N$38  (1 unrouted)
  Top 0.152: U$4.38 97.74,60.7 Q5.1
N$39
  Top 0.152: U$4.39 97.26,57.5 97.26,57.83 95.88,59.22 C52.2
N$40
  Top 0.152: U$4.29 99.27,53.83 100.46,52.63 C54.2
N$41
  Top 0.152: U$4.32 107.09,55.03 L13.2 110.47,55.2 C49.1
N$42
  Top 0.152: L13.1 107.17,53.11 | 107.17,53.11 107.12,53.06 L14.2 | U$4.31 105.64,54.63 107.17,53.11
N$43
  Top 0.152: U$4.30 101.79,54.23 L14.1 103.2,52.82 C47.2
N$44
  Top 0.152: L15.1 114.65,55.4 C49.2 112.45,53.87 C48.2
N$45
  Top 0.152: C50.2 116.88,53.91 L15.2 arc90 123.7,62.45 123.7,91.59 123.7,92.61 E1.ANT
  Top 2.032: L15.2 arc90 123.7,62.45 123.7,91.59
N$49
  Top 0.152: U$1.3 89.1,68.09 84.47,63.46 84.47,55.12 85.03,54.56 92.24,54.56 92.31,54.64 U$4.6
N$50  (via drill 0.35)
  Top 0.152: U$4.23 97.81,51.36 97.81,51.03 100.02,48.82 107.44,48.82 | 107.44,48.82 107.52,48.82 | 107.44,48.82 107.44,48.84 v107.52,48.84
  Bottom 0.152: v107.52,48.84 107.52,46.63 113.19,40.96 113.73,40.96 113.74,40.97 J6.2
N$51
  Top 0.152: T1.2 93.29,62.13 93.29,59.23 93.74,58.79 U$4.48
N$52  (via drill 0.35)
  Top 0.152: T1.3 96.69,65.27 v96.7,65.28
  Bottom 0.152: J7.2 94.64,65.3 96.72,65.3 v96.7,65.28
N$54
  Top 0.152: U$3.7 77.68,56.44 81.41,52.7 92.28,52.7 92.53,52.96 92.86,52.96 U$4.10
N$58
  Top 0.152: U$2.11 96.3,44.99 95.35,45.93 95.35,47.72 94.51,48.56 94.01,48.56 93.78,48.33 90.74,48.33 90.64,48.43 90.64,49.76 92.02,51.14 93.26,51.14 93.54,50.87 95.32,50.87 95.32,51.42 U$4.17
N$62
  Top 0.152: U$6.18 131.55,48.44 129.32,46.21 128.73,46.21 128.51,45.99 128.51,45.4 128.49,45.38 D1.A
N$63
  Top 0.152: U$6.19 131.95,48.21 129.24,45.49 D2.A
N$64
  Top 0.152: U$6.20 132.35,46.71 D3.A
N$65
  Top 0.152: U$6.21 132.75,45.9 D4.A
N$66
  Top 0.152: D5.A 95.94,70 93.83,72.12 U$1.18
N$67
  Top 0.152: U$1.19 97.32,72.51 D6.A
N$68  (1 unrouted)
  Top 0.152: U$1.20 98.2,72.91
N$69
  Top 0.152: U$1.21 96.33,73.31 97.38,74.37 D8.A
N$70
  Top 0.152: U$3.3 75.97,54.84 77.88,52.93 77.88,50.44 70.46,43.03 64.95,43.03 62.2,45.77 62.2,48.54 59.54,51.21 55.91,51.21 55.14,50.44 D12.A
N$71
  Top 0.152: U$3.4 76.41,55.24 79.17,52.48 79.17,50.57 70.97,42.37 64.77,42.37 61.85,45.29 61.85,48.34 59.38,50.8 57.05,50.8 56.54,50.29 D11.A
N$72
  Top 0.152: U$3.5 76.8,55.64 80.09,52.35 80.09,50.6 71.4,41.91 64.44,41.91 61.44,44.91 61.44,48.11 59.31,50.24 58.29,50.24 57.81,49.76 57.84,49.73 D10.A 57.84,48.52
N$73
  Top 0.152: U$3.6 77.36,56.04 81.13,52.27 81.13,50.62 71.7,41.2 64.34,41.2 60.94,44.6 60.94,47.52 59.8,48.65 D9.A
N$74
  Top 0.152: U$2.14 85.21,43.02 83.84,41.66 83.84,34.67 87.77,30.75 D13.A
N$75
  Top 0.152: U$2.15 86.11,42.62 84.68,41.2 84.68,35.28 88.65,31.32 88.65,29.39 88.19,28.93 D14.A
N$76
  Top 0.152: D15.A 87.84,27.52 89.26,28.94 89.26,32.33 85.19,36.4 85.19,40.97 86.45,42.22 U$2.16
N$77
  Top 0.152: U$2.17 87.27,41.82 85.8,40.36 85.8,36.65 90.09,32.36 90.09,28.56 D16.A
N$78
  Top 0.152: D5.C 102.91,70 R1.2
N$79
  Top 0.152: D6.C 101,72.06 R2.2
N$80
  Top 0.152: R3.2 101.51,74.47 100.94,73.91 100.94,73.86 100.72,73.64 100.68,73.64 D7.C
N$81
  Top 0.152: D8.C 102.78,76.94 R4.2
N$82
  Top 0.152: R5.2 127.41,42.05 D1.C
N$83
  Top 0.152: D2.C 127.99,42.48 R6.2
N$84
  Top 0.152: D3.C 130.25,42.86 R7.2
N$85
  Top 0.152: D4.C 133.17,41.06 R8.2
N$86
  Top 0.152: 84.26,30.86 R13.2 85.79,30.4 D13.C
N$87
  Top 0.152: 84.23,27.82 R14.2 85.33,28.22 D14.C
N$88
  Top 0.152: D15.C 84.47,25.98 R15.2
N$89
  Top 0.152: D16.C 83.91,24.13 R16.2
N$90
  Top 0.152: D12.C 55.14,41.64 R12.2
N$91
  Top 0.152: D11.C 56.54,40.57 R11.2
N$92
  Top 0.152: D10.C 57.84,41.16 R10.2
N$93
  Top 0.152: R9.2 59.08,42.17 D9.C
N$94
  Top 0.152: U$4.21 96.94,50.86 96.93,50.85 99.01,48.77 99.01,48.23 108.71,48.23 109.7,49.23 109.7,49.5 111.04,50.84 118.09,50.84 118.72,51.47 U$6.8 128.76,51.4
N$96
  Top 0.152: U$3.23 67.64,59.87 69.27,61.49 J4.1
N$97
  Top 0.152: U$3.24 67.24,59.96 66.73,60.48 J4.2
N$98
  Top 0.152: U$2.23 91.04,39.42 J5.1
N$99
  Top 0.152: U$2.24 93.18,39.02 J5.2
N$102
  Top 0.152: U$6.23 133.55,47.6 J2.1
N$103
  Top 0.152: U$6.24 135.45,47.57 135.45,46.89 139.5,42.84 J2.2
N$104
  Top 0.152: J1.1 99.67,77.42 96.36,74.11 U$1.23
N$105
  Top 0.152: U$1.24 94.61,74.51 J1.2
N$106  (via drill 0.35)
  Top 0.152: U$4.24 100.4,49.17 105.48,49.17 106.22,49.91 108.64,49.91 109.07,49.48 v109.09,49.48
  Bottom 0.152: v109.09,49.48 115.06,43.51 J6.1
SCK  (via drill 0.35)
  Top 0.152: U$1.6 90.3,67.75 85.92,63.37 v85.92,57.81 87.89,55.83 U$4.3 | v78.16,59.19 76.61,57.64 U$3.10 | U$2.8 97.5,44.74 97.96,45.2 v97.96,48.96 98.7,48.21 98.7,48.11 98.88,47.93 108.83,47.93 110,49.1 110,49.26 111.18,50.43 118.36,50.43 119.01,51.08 U$6.9
  Bottom 0.152: v78.16,59.19 78.96,58.39 84.4,58.39 84.98,57.81 v85.92,57.81 87.99,57.81 93.85,51.95 94.97,51.95 v97.96,48.96
VCC  (via drill 0.35)
  Top 0.152: 66.39,54.03 65.68,54 64.52,50.62 C42.2 62.15,50.52 v61.32,51.36 | 66.39,54.03 U$3.36 | U$3.1 73.12,54.04 C40.2 75.64,50.11 v75.51,49.99 | U$3.12 72.86,58.44 C44.2 76.31,60.1 76.49,60.27 76.52,60.27 v76.57,60.22 | U$2.35 U$2.36 100.3,37.6 100.33,37.57 100.53,37.57 100.74,37.57 C31.2 101.93,36.58 v101.93,38 | U$2.1 100.3,44.74 100.72,45.17 101.06,45.17 101.27,45.38 101.27,45.72 101.65,46.1 C29.2 103.86,46.1 v103.96,46.2 | U$2.12 95.89,44.62 C33.2 94.61,47.6 v94.26,47.95 90.5,47.95 89.53,48.92 C55.2 92.57,52.23 U$4.12 | U$6.35 U$6.36 135.27,54.27 135.31,54.3 135.31,55.22 C9.2 142.62,56.31 J3.1 | U$6.1 127.57,54.27 127.14,54.7 | U$1.1 88.3,68.82 87.07,67.59 C18.2 86.92,67.34 v85.42,65.84 | C22.2 93.68,69.31 U$1.12 | U$1.35 U$1.36 88.3,76.22 C20.2 87.61,78.59 v87.88,78.87 | U$4.1 91.27,56.63 C51.2 91.39,57.23 92.2,58.03 92.19,58.03 v92.17,58.02 | U$4.35 U$4.36 100.62,56.63 C53.2 100.66,56.64 v103.28,56.64 | 127.14,54.7 C7.2 | U$6.12 127.67,49.87 C11.2 127.04,49.45 125.98,48.39 125.98,47.72 v125.07,46.82 | v124.84,54.66 127.1,54.66 127.14,54.7 | C22.2 95.22,67.03 93.33,65.14 T1.1 | C22.2 96.74,67.77 98.17,66.34 98.17,66.27 v98.18,66.25 | U$3.35 66.44,54.08 66.39,54.03
  Bottom 0.152: J3.1 134.34,55.57 125.81,55.57 124.84,54.61 | 124.84,54.61 v124.84,54.66 124.84,47.05 v125.07,46.82 | 124.84,54.61 105.31,54.61 103.33,56.59 | 103.33,56.59 v103.28,56.64 103.33,56.59 | 103.33,56.59 106.35,53.57 106.35,52.4 103.96,50.01 v103.96,46.2 | v103.96,46.2 96.01,46.2 94.27,47.94 | 94.27,47.94 v94.26,47.95 | v103.96,46.2 102.01,44.25 102.01,38.07 v101.93,38 | v75.51,49.99 84.96,49.99 87.01,47.94 94.27,47.94 | v75.51,49.99 62.69,49.99 v61.32,51.36 | 92.84,58.65 88.59,58.65 87.17,60.07 87.17,64.08 v85.42,65.84 85.42,76.4 v87.88,78.87 | 92.84,58.65 94.14,58.65 | 94.14,58.65 101.27,58.65 103.33,56.59 | v98.18,66.25 98.18,62.69 94.14,58.65 | v76.57,60.22 75.51,59.17 v75.51,49.99 | v92.17,58.02 92.8,58.65 92.84,58.65

### Text on the board
tNames: UB NANO